# Altium schematic sheet Mainboard_Power_Interface.SchDoc
size A4
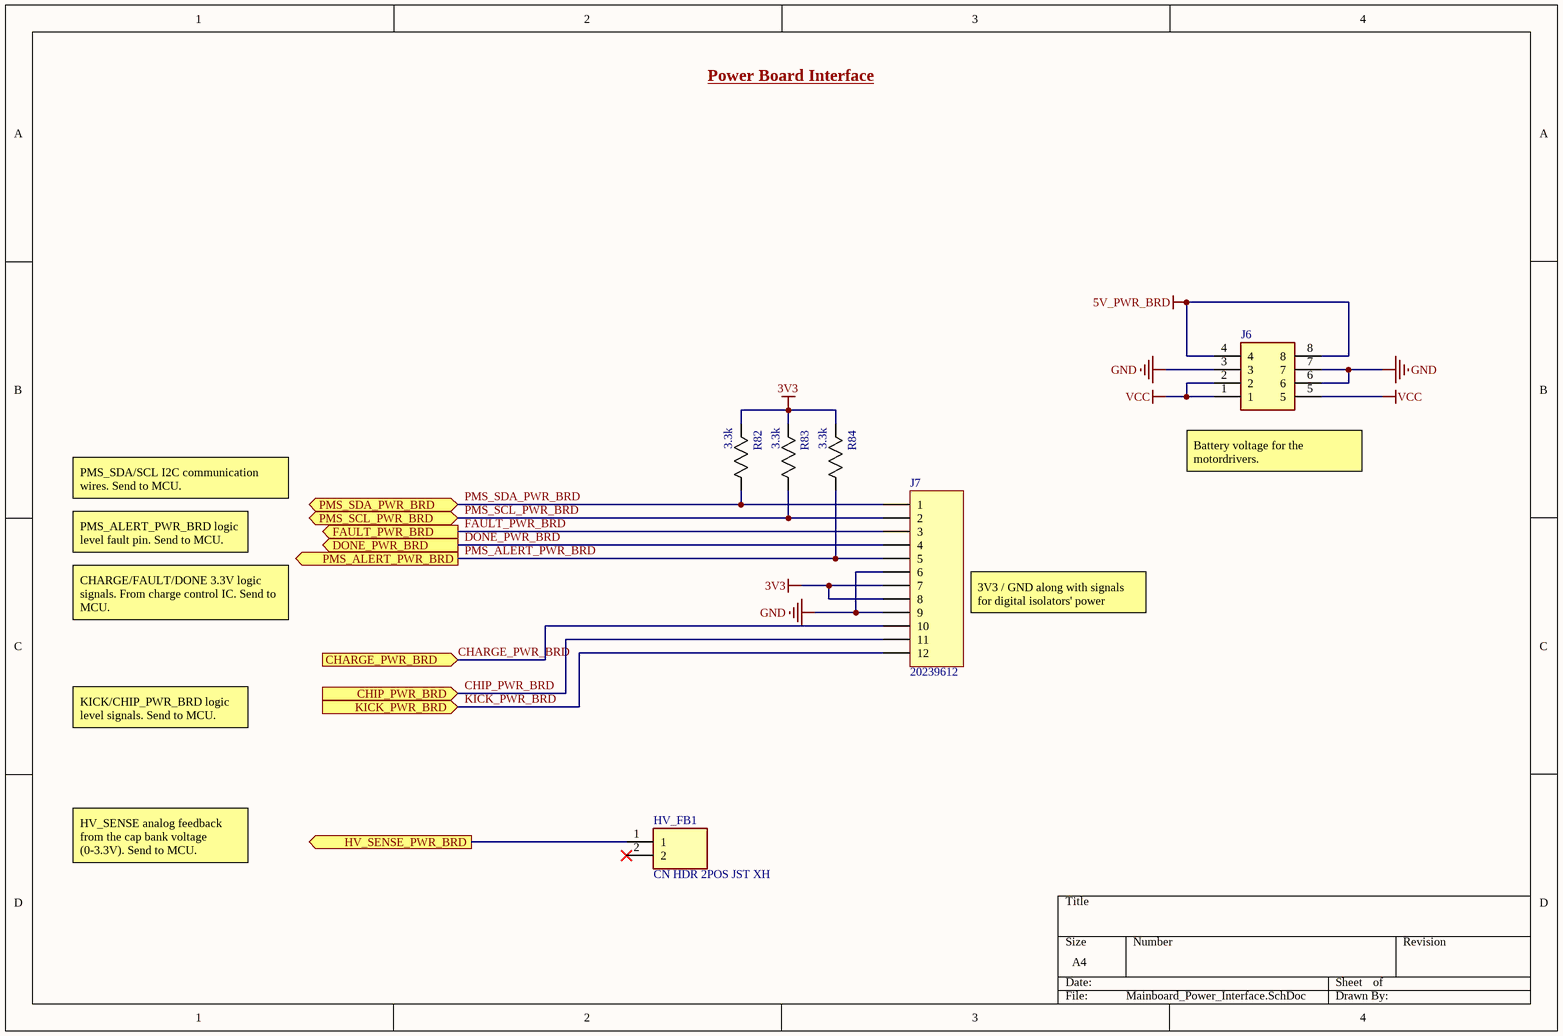
[diagram p0: Mainboard_Power_Interface.SchDoc]

## Parts
HV_FB1  CN HDR 2POS JST XH  [JST_B2B-XH-A(LF)(SN)]
J6  CN HDR 8POS Molex 43045-0812 (R)  [4304508]  (value not drawn)
J7  20239612  [CN 20355612]
R82  3.3k  [0603]
R83  3.3k  [0603]
R84  3.3k  [0603]

## Ports
CHARGE_PWR_BRD (in), CHIP_PWR_BRD (in), DONE_PWR_BRD (out), FAULT_PWR_BRD (out), HV_SENSE_PWR_BRD (out), KICK_PWR_BRD (in), PMS_ALERT_PWR_BRD (out), PMS_SCL_PWR_BRD (bidir), PMS_SDA_PWR_BRD (bidir)

## Nets
3V3: J7.7 J7.8 R82.2(R2) R83.2(R2) R84.2(R2)
5V_PWR_BRD: J6.4 J6.8
GND: J6.3 J6.6 J6.7 J7.6 J7.9
VCC: J6.1 J6.2 J6.5
CHARGE_PWR_BRD: J7.10 ; port CHARGE_PWR_BRD
CHIP_PWR_BRD: J7.11 ; port CHIP_PWR_BRD
DONE_PWR_BRD: J7.4 ; port DONE_PWR_BRD
FAULT_PWR_BRD: J7.3 ; port FAULT_PWR_BRD
HV_SENSE_PWR_BRD: HV_FB1.1 ; port HV_SENSE_PWR_BRD
KICK_PWR_BRD: J7.12 ; port KICK_PWR_BRD
PMS_ALERT_PWR_BRD: J7.5 R84.1(R1) ; port PMS_ALERT_PWR_BRD
PMS_SCL_PWR_BRD: J7.2 R83.1(R1) ; port PMS_SCL_PWR_BRD
PMS_SDA_PWR_BRD: J7.1 R82.1(R1) ; port PMS_SDA_PWR_BRD

Not connected (* = marked no-connect by the designer): HV_FB1 2*

## Notes on the sheet
- Power Board Interface
- PMS_SDA/SCL I2C communication wires. Send to MCU.
- (near J6) Battery voltage for the motordrivers.
- PMS_ALERT_PWR_BRD logic level fault pin. Send to MCU.
- CHARGE/FAULT/DONE 3.3V logic signals. From charge control IC. Send to MCU.
- 3V3 / GND along with signals for digital isolators' power
- KICK/CHIP_PWR_BRD logic level signals. Send to MCU.
- HV_SENSE analog feedback from the cap bank voltage (0-3.3V). Send to MCU.

## Library data of the parts
HV_FB1 = CN HDR 2POS JST XH: Connector Header Through Hole 2 position 0.098 _2.50mm_ / JST XH; MP: B2B-XH-A_LF__SN_; MF: JST Sales; Price: None; Package: None; Value: *; Availability: Unavailable; SnapEDA_Link: https://www.snapeda.com/parts/B2B-XH-A%28LF%29%28SN%29/JST%20Sales%20America%20Inc./view-part/492310/?ref=snap
J6 = CN HDR 8POS Molex 43045-0812 (R): Molex 43045-0812 8POS Microfit / DR TH Vertical
J7 = CN Pico Clasp 12POS: 12 POS Right Angle Pico Clasp Surface Mount
R82-R84 = RES 3.3k 1/8W: RES SMD 3.3K OHM 5% 1/8W 0805; Power (Watts): 0.125W; Package: 0805; Value: 3.3k; Tolerance: 5%